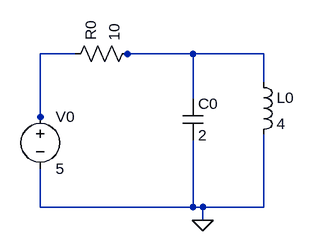
[diagram p0: schematic test.asc]
test.asc, the LTspice schematic file:
Version 4
SHEET 1 880 680
WIRE 375 241 375 172
WIRE 375 305 375 408
WIRE 140 269 140 269
WIRE 140 349 140 408
WIRE 390 428 390 408
WIRE 390 428 390 408
WIRE 484 216 484 172
WIRE 484 296 484 408
WIRE 194 172 140 172
WIRE 274 172 274 172
WIRE 140 408 484 408
WIRE 140 172 140 269
WIRE 274 172 484 172
SYMBOL cap 359 241 R0
SYMATTR InstName C0
SYMATTR Value 2
SYMBOL voltage 140 253 R0
SYMATTR InstName V0
SYMATTR Value 5
FLAG 390 428 0
SYMBOL ind 468 200 R0
SYMATTR InstName L0
SYMATTR Value 4
SYMBOL res 178 188 R270
SYMATTR InstName R0
SYMATTR Value 10

The netlist it stands for:
* test.asc
C0 N001 0 2
V0 N002 0 5
L0 N001 0 4
R0 N002 N001 10
.backanno
.end